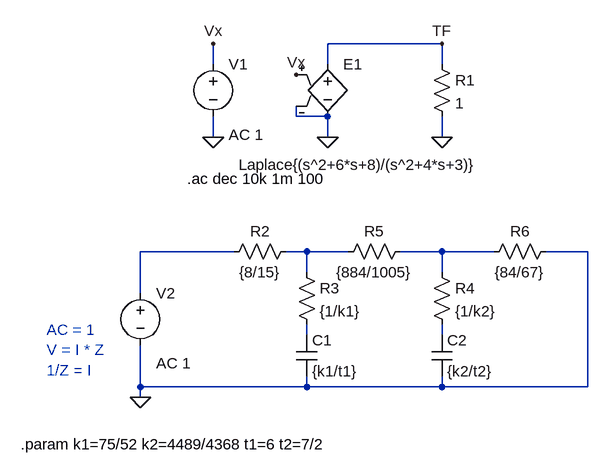
[diagram p0: schematic TS10_2.asc]
TS10_2.asc, the LTspice schematic file:
Version 4
SHEET 1 880 680
WIRE 448 -48 272 -48
WIRE 96 -16 96 -48
WIRE 272 -16 272 -48
WIRE 448 -16 448 -48
WIRE 224 64 224 48
WIRE 272 64 224 64
WIRE 96 96 96 64
WIRE 272 96 272 64
WIRE 448 96 448 64
WIRE 128 272 -16 272
WIRE 240 272 208 272
WIRE 304 272 240 272
WIRE 448 272 384 272
WIRE 528 272 448 272
WIRE 672 272 608 272
WIRE 240 304 240 272
WIRE 448 304 448 272
WIRE -16 336 -16 272
WIRE 240 400 240 384
WIRE 448 400 448 384
WIRE -16 480 -16 416
WIRE 240 480 240 464
WIRE 240 480 -16 480
WIRE 448 480 448 464
WIRE 448 480 240 480
WIRE 672 480 672 272
WIRE 672 480 448 480
WIRE -16 496 -16 480
FLAG 272 96 0
FLAG 96 96 0
FLAG 96 -48 Vx
FLAG 224 0 Vx
FLAG 448 96 0
FLAG -16 496 0
FLAG 448 -48 TF
SYMBOL voltage 96 -32 R0
WINDOW 123 24 124 Left 2
WINDOW 39 0 0 Left 0
SYMATTR Value2 AC 1
SYMATTR InstName V1
SYMATTR Value ""
SYMBOL e 272 -32 R0
WINDOW 3 -137 170 Left 2
SYMATTR Value Laplace{(s^2+6*s+8)/(s^2+4*s+3)}
SYMATTR InstName E1
SYMBOL res 432 -32 R0
SYMATTR InstName R1
SYMATTR Value 1
SYMBOL voltage -16 320 R0
WINDOW 123 24 124 Left 2
WINDOW 39 0 0 Left 0
SYMATTR Value2 AC 1
SYMATTR InstName V2
SYMATTR Value ""
SYMBOL res 224 256 R90
WINDOW 0 0 56 VBottom 2
WINDOW 3 32 56 VTop 2
SYMATTR InstName R2
SYMATTR Value {8/15}
SYMBOL res 224 288 R0
SYMATTR InstName R3
SYMATTR Value {1/k1}
SYMBOL cap 224 400 R0
SYMATTR InstName C1
SYMATTR Value {k1/t1}
SYMBOL res 432 288 R0
SYMATTR InstName R4
SYMATTR Value {1/k2}
SYMBOL cap 432 400 R0
SYMATTR InstName C2
SYMATTR Value {k2/t2}
SYMBOL res 400 256 R90
WINDOW 0 0 56 VBottom 2
WINDOW 3 32 56 VTop 2
SYMATTR InstName R5
SYMATTR Value {884/1005}
SYMBOL res 624 256 R90
WINDOW 0 0 56 VBottom 2
WINDOW 3 32 56 VTop 2
SYMATTR InstName R6
SYMATTR Value {84/67}
TEXT 56 160 Left 2 !.ac dec 10k 1m 100
TEXT -160 392 Left 2 ;AC = 1\nV = I * Z\n1/Z = I
TEXT -200 568 Left 2 !.param k1=75/52 k2=4489/4368 t1=6 t2=7/2

The netlist it stands for:
* TS10_2.asc
V1 Vx 0 AC 1
E1 TF 0 Vx 0 Laplace{(s^2+6*s+8)/(s^2+4*s+3)}
R1 TF 0 1
V2 N001 0 AC 1
R2 N002 N001 {8/15}
R3 N002 N004 {1/k1}
C1 N004 0 {k1/t1}
R4 N003 N005 {1/k2}
C2 N005 0 {k2/t2}
R5 N003 N002 {884/1005}
R6 0 N003 {84/67}
.ac dec 10k 1m 100
* AC = 1
* V = I * Z
* 1/Z = I
.param k1=75/52 k2=4489/4368 t1=6 t2=7/2
.backanno
.end